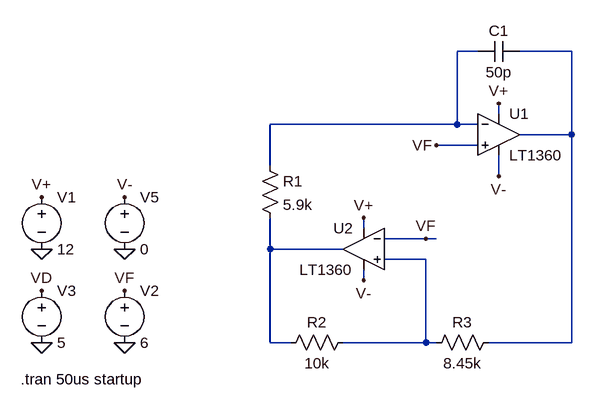
[diagram p0: schematic vco_opamp.asc]
vco_opamp.asc, the LTspice schematic file:
Version 4
SHEET 1 1396 1184
WIRE 336 192 304 192
WIRE 480 192 400 192
WIRE 368 288 368 272
WIRE 304 304 304 192
WIRE 304 304 16 304
WIRE 336 304 304 304
WIRE 480 320 480 192
WIRE 480 320 400 320
WIRE 336 336 272 336
WIRE 16 368 16 304
WIRE 368 384 368 352
WIRE 160 464 160 448
WIRE 256 480 192 480
WIRE 272 480 256 480
WIRE 16 496 16 448
WIRE 128 496 16 496
WIRE 256 512 192 512
WIRE 160 544 160 528
WIRE 16 640 16 496
WIRE 48 640 16 640
WIRE 256 640 256 512
WIRE 256 640 128 640
WIRE 272 640 256 640
WIRE 480 640 480 320
WIRE 480 640 352 640
FLAG -336 416 V+
FLAG -336 496 0
FLAG -208 560 VF
FLAG -336 640 0
FLAG -336 560 VD
FLAG -208 496 0
FLAG -208 416 V-
FLAG -208 640 0
FLAG 368 272 V+
FLAG 160 448 V+
FLAG 368 384 V-
FLAG 160 544 V-
FLAG 256 480 VF
FLAG 272 336 VF
SYMBOL voltage -336 400 R0
WINDOW 123 0 0 Left 2
WINDOW 39 0 0 Left 2
SYMATTR InstName V1
SYMATTR Value 12
SYMBOL voltage -336 544 R0
WINDOW 123 0 0 Left 2
WINDOW 39 0 0 Left 2
SYMATTR InstName V3
SYMATTR Value 5
SYMBOL voltage -208 400 R0
WINDOW 123 0 0 Left 2
WINDOW 39 0 0 Left 2
SYMATTR InstName V5
SYMATTR Value 0
SYMBOL voltage -208 544 R0
WINDOW 123 0 0 Left 2
WINDOW 39 0 0 Left 2
SYMATTR InstName V2
SYMATTR Value 6
SYMBOL res 0 352 R0
SYMATTR InstName R1
SYMATTR Value 5.9k
SYMBOL res 144 624 R90
WINDOW 0 0 56 VBottom 2
WINDOW 3 32 56 VTop 2
SYMATTR InstName R2
SYMATTR Value 10k
SYMBOL res 368 624 R90
WINDOW 0 0 56 VBottom 2
WINDOW 3 32 56 VTop 2
SYMATTR InstName R3
SYMATTR Value 8.45k
SYMBOL cap 400 176 R90
WINDOW 0 0 32 VBottom 2
WINDOW 3 32 32 VTop 2
SYMATTR InstName C1
SYMATTR Value 50p
SYMBOL Opamps\\LT1360 368 256 R0
SYMATTR InstName U1
SYMBOL Opamps\\LT1360 160 432 M0
SYMATTR InstName U2
TEXT -368 696 Left 2 !.tran 50us startup

The netlist it stands for:
* vco_opamp.asc
V1 V+ 0 12
V3 VD 0 5
V5 V- 0 0
V2 VF 0 6
R1 N001 N003 5.9k
R2 N004 N003 10k
R3 N002 N004 8.45k
C1 N002 N001 50p
XU1 VF N001 V+ V- N002 LT1360  ; pins In+ In- V+ V- OUT
XU2 N004 VF V+ V- N003 LT1360  ; pins In+ In- V+ V- OUT
.tran 50us startup
.backanno
.end